# EAGLE board LiPoLoader (EAGLE 5.07)
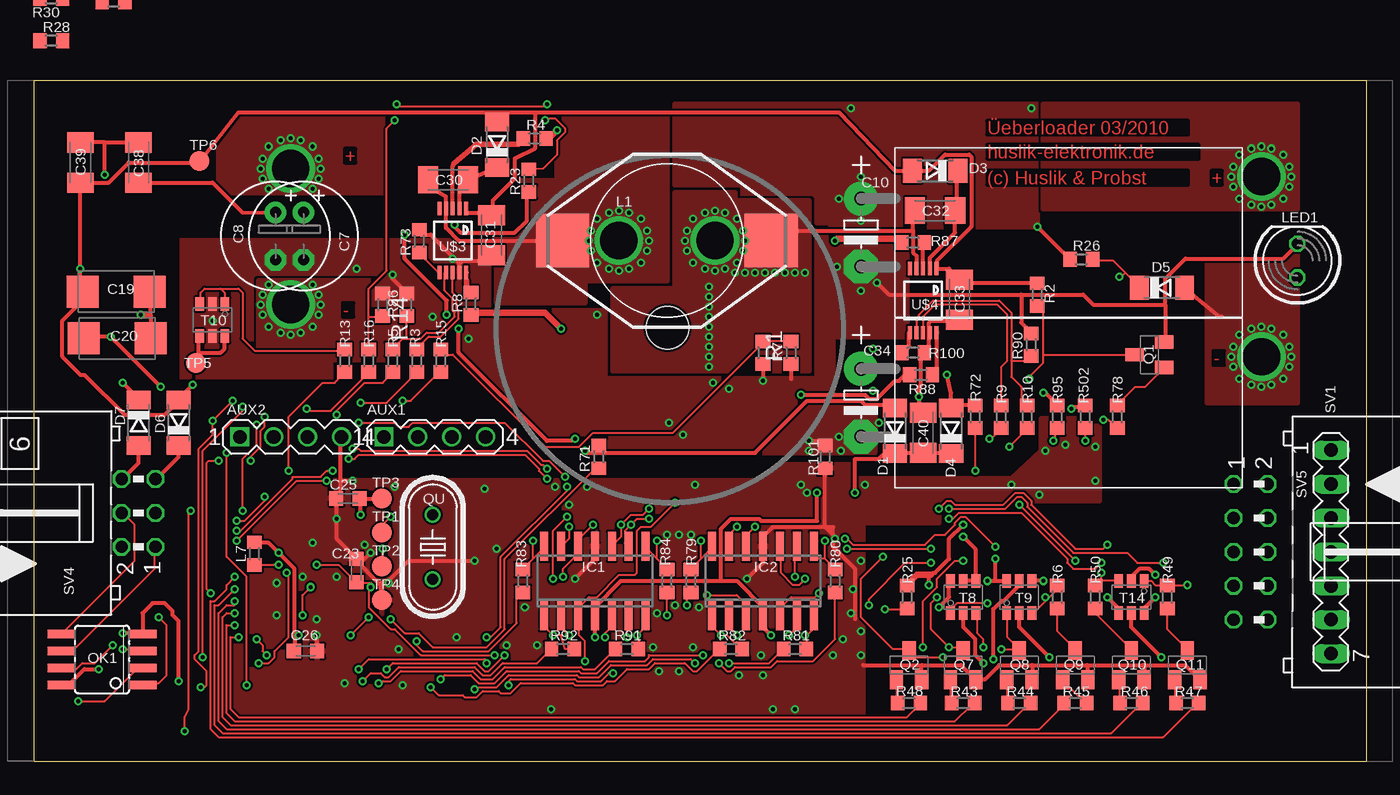
[diagram p2: board, top side]
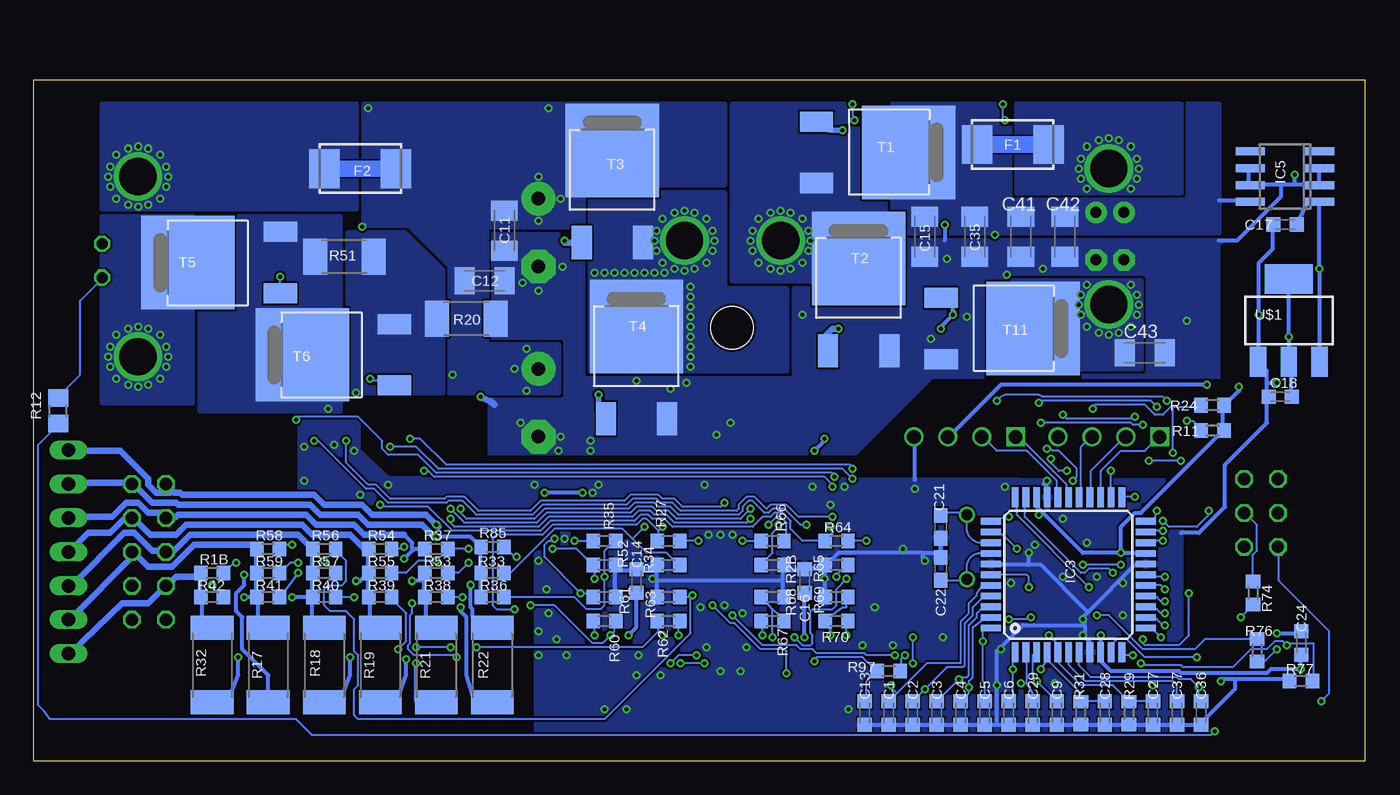
[diagram p3: board, bottom side, seen from below]

Size 99.8 x 51 mm. Coordinates in mm from the lower left corner, seen from the top.
Copper layers (1*16): Top 0.035mm / dielectric 1.5mm / Bottom 0.035mm
Design rules "Fischer-LP *": minimum track width 0.15mm, minimum drill 0.3mm, track to track 0.15mm, track to pad 0.15mm, pad to pad 0.15mm, via to via 0.15mm, smd to smd 0mil, copper to edge 0.2mm, drill to drill 0.3mm, minimum pad ring 0.2mm, minimum via ring 0.15mm, stop-mask expansion 0.1mm, vias tented up to drill 0.5mm, thermal gap 0.15mm
Net classes: 1 Hi-Power: width 0.3 mm; 2 Lo-Power: width 0.3 mm; 3 Iso-bus: clearance 0.6 mm to class 0, clearance 0.6 mm to class 1, clearance 0.6 mm to class 2
Holes 3.2 mm at 47.46,32.46
tRestrict: 16 lines
bRestrict: 9 lines
vRestrict: area 22.6,28.6 to 30.4,29.9

## Footprints (pad centres in the part's own frame; a part is rotated, then mirrored left to right if it is on the bottom)
MA04-1 = drill 1.016 square: 1 -3.81,0 | drill 1.016 round: 2 -1.27,0; 3 1.27,0; 4 3.81,0
SOLPAD3MM = drill 2.8 round: P$1 0,0
C0603K = smd 1.05 x 1.08: 1 -0.875,0; 2 0.875,0
E3,5-8 = drill 0.813 pad 1.6 round: + -1.778,0 | drill 0.813 pad 1.6 octagon: - 1.778,0
E5-13-L = drill 1.016 pad 2.54 round: + -2.54,0 | drill 1.016 pad 2.54 octagon: - 2.54,0
C1206K = smd 1.5 x 2: 1 -1.5,0; 2 1.5,0
SMC_C = smd 2.4 x 2.4: + -2.5,0; - 2.5,0
C0603 = smd 1.1 x 1: 1 -0.85,0; 2 0.85,0
SOD80C = smd 1.4 x 1.8: A 1.7,0; C -1.7,0
WSC2515 = smd 2.29 x 2.92: 1 -2.675,0; 2 2.675,0
SO14 = smd 0.6 x 2.2: 1 -3.81,-2.6; 2 -2.54,-2.6; 3 -1.27,-2.6; 4 0,-2.6; 5 1.27,-2.6; 6 2.54,-2.6; 7 3.81,-2.6; 8 3.81,2.6; 9 2.54,2.6; 10 1.27,2.6; 11 0,2.6; 12 -1.27,2.6; 13 -2.54,2.6; 14 -3.81,2.6
TQFP44 = smd 1.5 x 0.5: 1 -5.8,4; 2 -5.8,3.2; 3 -5.8,2.4; 4 -5.8,1.6; 5 -5.8,0.8; 6 -5.8,0; 7 -5.8,-0.8; 8 -5.8,-1.6; 9 -5.8,-2.4; 10 -5.8,-3.2; 11 -5.8,-4; 23 5.8,-4; 24 5.8,-3.2; 25 5.8,-2.4; 26 5.8,-1.6; 27 5.8,-0.8; 28 5.8,0; 29 5.8,0.8; 30 5.8,1.6; 31 5.8,2.4; 32 5.8,3.2; 33 5.8,4 | smd 0.5 x 1.5: 12 -4,-5.8; 13 -3.2,-5.8; 14 -2.4,-5.8; 15 -1.6,-5.8; 16 -0.8,-5.8; 17 0,-5.8; 18 0.8,-5.8; 19 1.6,-5.8; 20 2.4,-5.8; 21 3.2,-5.8; 22 4,-5.8; 34 4,5.8; 35 3.2,5.8; 36 2.4,5.8; 37 1.6,5.8; 38 0.8,5.8; 39 0,5.8; 40 -0.8,5.8; 41 -1.6,5.8; 42 -2.4,5.8; 43 -3.2,5.8; 44 -4,5.8
SO08 = smd 0.6 x 2.2: 1 -1.905,-2.6; 2 -0.635,-2.6; 3 0.635,-2.6; 4 1.905,-2.6; 5 1.905,2.6; 6 0.635,2.6; 7 -0.635,2.6; 8 -1.905,2.6
D333 = smd 4 x 4: 1 -7.82,0; 2 7.82,0
R0603 = smd 1 x 1.1: 1 -0.85,0; 2 0.85,0
LED5MM = drill 0.813 octagon: A -1.27,0; K 1.27,0
SOIC08 = smd 0.66 x 2.032: 1 -1.905,-3.073; 2 -0.635,-3.073; 3 0.635,-3.073; 4 1.905,-3.073; 5 1.905,3.073; 6 0.635,3.073; 7 -0.635,3.073; 8 -1.905,3.073
SOT23-BEC = smd 1 x 1.4: B -0.95,-1.1; C 0,1.1; E 0.95,-1.1
HC49U-V = drill 0.813 round: 1 -2.413,0; 2 2.413,0
R0805 = smd 1.3 x 1.5: 1 -0.95,0; 2 0.95,0
R2512 = smd 1.8 x 3.2: 1 -2.8,0; 2 2.8,0
R2010 = smd 1.8 x 2.7: 1 -2.2,0; 2 2.2,0
MA07-1 = drill 1.016 long: 1 -7.62,0; 2 -5.08,0; 3 -2.54,0; 4 0,0; 5 2.54,0; 6 5.08,0; 7 7.62,0
ML6L = drill 0.914 octagon: 1 -2.54,-1.27; 2 -2.54,1.27; 3 0,-1.27; 4 0,1.27; 5 2.54,-1.27; 6 2.54,1.27
ML10L = drill 0.914 octagon: 1 -5.08,-1.27; 2 -5.08,1.27; 3 -2.54,-1.27; 4 -2.54,1.27; 5 0,-1.27; 6 0,1.27; 7 2.54,-1.27; 8 2.54,1.27; 9 5.08,-1.27; 10 5.08,1.27
DPAK = smd 1.5 x 2.5: 1 -2.3,-6.9; 3 2.3,-6.9 | smd 7 x 7: 4 0,0
SUPERSOT-6 = smd 0.65 x 1: P$1 -0.95,-1.2; P$2 0,-1.2; P$3 0.95,-1.2; P$4 0.95,1.2; P$5 0,1.2; P$6 -0.95,1.2
TP15R = smd 1.5 x 1.5: TP 0,0
SOT223 = smd 1.219 x 2.235: LEFT -2.311,-3.099; MID 0,-3.099; RIGHT 2.311,-3.099 | smd 3.6 x 2.2: TAP 0,3.099
MSOP10W = smd 0.3 x 1: 1 -1,-2.4; 2 -0.5,-2.4; 3 0,-2.4; 4 0.5,-2.4; 5 1,-2.4; 6 1,2.4; 7 0.5,2.4; 8 0,2.4; 9 -0.5,2.4; 10 -1,2.4

## Placement (x,y rotation side)
AUX1  aux  [MA04-1]  30,24.3 0 top
AUX2  encoder  [MA04-1]  19.2,24.3 0 top
BATT+  SOLPAD3MM  [SOLPAD3MM]  91.95,43.8 0 top
BATT-  SOLPAD3MM  [SOLPAD3MM]  91.95,30.3 0 top
C1  100n  [C0603K]  35.7,3.6 90 bottom
C2  100n  [C0603K]  33.9,3.6 90 bottom
C3  100n  [C0603K]  32.1,3.6 90 bottom
C4  100n  [C0603K]  30.3,3.6 90 bottom
C5  100n  [C0603K]  28.5,3.6 90 bottom
C6  100n  [C0603K]  26.7,3.6 90 bottom
C7  330µF / 25V  [E3,5-8]  20.16,39.34 270 top
C8  330µF / 25V  [E3,5-8]  18.07,39.34 270 top
C9  100n  [C0603K]  23.1,3.6 90 bottom
C10  1000µF/35V  [E5-13-L]  61.95,39.6 270 top
C11  1u  [C1206K]  64.5,39.75 90 bottom
C12  10µF  [C1206K]  66,36 0 bottom
C13  100n  [C0603K]  37.5,3.6 90 bottom
C14  100n  [C0603K]  54.6,13.5 270 bottom
C15  1u  [C1206K]  33,39.3 90 bottom
C16  100n  [C0603K]  42,13.5 270 bottom
C17  100n  [C0603K]  6,40.2 0 bottom
C18  100n  [C0603K]  6.35,27.3 0 bottom
C19  100u Tan  [SMC_C]  6.13,35.18 0 top
C20  100u Tan  [SMC_C]  6.2,31.67 0 top
C21  10p  [C0603]  31.8,17.55 90 bottom
C22  10p  [C0603]  31.8,14.4 270 bottom
C23  100n  [C0603K]  24.13,14.29 270 top
C24  100n  [C0603K]  4.78,8.86 270 bottom
C25  100n  [C0603K]  23.5,19.68 0 top
C26  100n  [C0603K]  20.32,8.26 180 top
C27  100n  [C0603K]  15.9,3.6 90 bottom
C28  100n  [C0603K]  19.5,3.6 90 bottom
C29  100n  [C0603K]  24.9,3.6 90 bottom
C30  1u  [C1206K]  31.01,43.56 0 top
C31  1u  [C1206K]  34.26,39.41 90 top
C32  1u  [C1206K]  67.5,41.25 0 top
C33  1u  [C1206K]  69.33,34.58 90 top
C34  1000µF/35V  [E5-13-L]  61.95,26.85 270 top
C35  10µF  [C1206K]  29.25,39.3 270 bottom
C36  100n  [C0603K]  12.3,3.6 90 bottom
C37  100n  [C0603K]  14.1,3.6 90 bottom
C38  1u  [C1206K]  7.8,44.85 270 top
C39  1u  [C1206K]  3.45,44.85 270 top
C40  1u  [C1206K]  66.6,24.6 270 top
C41  10µF  [C1206K]  25.8,39.3 270 bottom
C42  10µF  [C1206K]  22.5,39.3 270 bottom
C43  10µF  [C1206K]  16.5,30.6 0 bottom
COIL1  SOLPAD3MM  [SOLPAD3MM]  43.8,39 0 top
COIL2  SOLPAD3MM  [SOLPAD3MM]  51,39 0 top
D1  LL43-GS08  [SOD80C]  64.5,24.75 90 top
D2  LL43-GS08  [SOD80C]  34.67,46.18 90 top
D3  LL43-GS08  [SOD80C]  67.5,44.25 180 top
D4  LL43-GS08  [SOD80C]  68.7,24.75 90 top
D5  15V BZT55C15  [SOD80C]  84.5,35.48 0 top
D6  LL43-GS08  [SOD80C]  10.8,25.35 90 top
D7  LL43-GS08  [SOD80C]  7.8,25.35 270 top
F1  Fuse 10A  [WSC2515]  26.4,46.2 0 bottom
F2  Fuse 10A  [WSC2515]  75.3,44.4 180 bottom
IC1  LM224D  [SO14]  42,13.5 0 top
IC2  LM224D  [SO14]  54.6,13.5 0 top
IC3  AVR_XMEGA_A4_44A  [TQFP44]  22.23,13.97 90 bottom
IC5  78L12SMD  [SO08]  6,43.8 90 bottom
L1  COILCRAFT_D333  [D333]  47.4,39 0 top
L7  27nH  [R0603]  16.49,15.56 90 top
LED1  [LED5MM]  94.65,37.5 90 top
OK1  ILD217  [SOIC08]  5.08,7.62 90 top
Q1  BC817-25SMD  [SOT23-BEC]  83.55,30.45 90 top
Q2  BC817-25SMD  [SOT23-BEC]  65.55,7.2 0 top
Q7  BC817-25SMD  [SOT23-BEC]  69.6,7.2 0 top
Q8  BC817-25SMD  [SOT23-BEC]  73.8,7.2 0 top
Q9  BC817-25SMD  [SOT23-BEC]  78,7.2 0 top
Q10  BC817-25SMD  [SOT23-BEC]  82.2,7.2 0 top
Q11  BC817-25SMD  [SOT23-BEC]  86.4,7.2 0 top
QU  16MHz  [HC49U-V]  29.85,16.05 90 top
R1  2k2  [R0603]  56.7,30.6 90 top
R1B  43k - 0.1%  [R0603]  86.4,14.1 0 bottom
R2  10k  [R0603]  75.15,34.95 90 top
R2B  20k - 0.1%  [R0603]  44.4,14.7 180 bottom
R3  0R  [R0603]  28.65,30 90 top
R4  10  [R0603]  37.49,46.66 180 top
R5  0R  [R0603]  26.85,30 90 top
R6  10k  [R0603]  76.65,12.3 90 top
R7  NB12K00103JBB  [R0603]  54.6,30.6 90 top
R8  10  [R0603]  32.72,34.27 90 top
R9  0R  [R0603]  72.45,25.8 270 top
R10  0R  [R0603]  74.4,25.8 270 top
R11  2k2  [R0603]  11.43,24.77 0 bottom
R12  330  [R0805]  97.95,26.25 90 bottom
R13  0R  [R0603]  23.25,30 90 top
R14  2k2  [R0603]  26.1,34.2 270 top
R15  0R  [R0603]  30.45,30 270 top
R16  0R  [R0603]  25.05,30 270 top
R17  10  [R2512]  82.2,7.2 270 bottom
R18  10  [R2512]  78,7.2 270 bottom
R19  10  [R2512]  73.8,7.2 270 bottom
R20  0.005R  [R2010]  67.35,33.15 180 bottom
R21  10  [R2512]  69.6,7.2 270 bottom
R22  10  [R2512]  65.4,7.2 270 bottom
R23  NB12K00103JBB  [R0603]  37.05,43.5 90 top
R24  2k2  [R0603]  11.43,26.67 0 bottom
R25  43k - 0.1%  [R0603]  65.4,12.3 270 top
R26  100k  [R0603]  78.45,37.6 0 top
R27  20k - 0.1%  [R0603]  52.2,16.5 180 bottom
R28  33k - 0.1%  [R0603]  1.27,53.98 0 top
R29  10k - 0.1%  [R0603]  17.7,3.6 270 bottom
R30  43k - 0.1%  [R0603]  1.27,57.15 180 top  (outside the outline)
R31  10k - 0.1%  [R0603]  21.3,3.6 270 bottom
R32  10  [R2512]  86.4,7.2 270 bottom
R33  43k - 0.1%  [R0603]  65.4,14.1 0 bottom
R34  20k - 0.1%  [R0603]  52.2,14.7 0 bottom
R35  20k - 0.1%  [R0603]  57,16.5 0 bottom
R36  43k - 0.1%  [R0603]  65.4,12.3 0 bottom
R37  43k - 0.1%  [R0603]  69.6,15.9 0 bottom
R38  10k  [R0603]  69.6,12.3 180 bottom
R39  10k  [R0603]  73.8,12.3 180 bottom
R40  10k  [R0603]  78,12.3 180 bottom
R41  10k  [R0603]  82.2,12.3 180 bottom
R42  10k  [R0603]  86.4,12.3 180 bottom
R43  4k7  [R0603]  69.6,4.35 180 top
R44  4k7  [R0603]  73.8,4.35 180 top
R45  4k7  [R0603]  78,4.35 0 top
R46  4k7  [R0603]  82.2,4.35 180 top
R47  4k7  [R0603]  86.4,4.35 180 top
R48  4k7  [R0603]  65.55,4.35 180 top
R49  10k  [R0603]  84.9,12.3 90 top
R50  10k  [R0603]  79.5,12.3 90 top
R51  0.1R  [R2010]  76.5,37.8 180 bottom
R52  20k - 0.1%  [R0603]  57,14.7 180 bottom
R53  43k - 0.1%  [R0603]  69.6,14.1 0 bottom
R54  43k - 0.1%  [R0603]  73.8,15.9 0 bottom
R55  43k - 0.1%  [R0603]  73.8,14.1 0 bottom
R56  43k - 0.1%  [R0603]  78,15.9 0 bottom
R57  43k - 0.1%  [R0603]  78,14.1 0 bottom
R58  43k - 0.1%  [R0603]  82.2,15.9 0 bottom
R59  43k - 0.1%  [R0603]  82.2,14.1 0 bottom
R60  20k - 0.1%  [R0603]  57,10.5 0 bottom
R61  20k - 0.1%  [R0603]  57,12.3 180 bottom
R62  20k - 0.1%  [R0603]  52.2,10.5 180 bottom
R63  20k - 0.1%  [R0603]  52.2,12.3 0 bottom
R64  20k - 0.1%  [R0603]  39.6,16.5 180 bottom
R65  20k - 0.1%  [R0603]  39.6,14.7 0 bottom
R66  20k - 0.1%  [R0603]  44.4,16.5 0 bottom
R67  10k - 0.1%  [R0603]  44.4,10.5 0 bottom
R68  2k - 0.1%  [R0603]  44.4,12.3 0 bottom
R69  2k - 0.1%  [R0603]  39.6,12.3 180 bottom
R70  36k - 0.1%  [R0603]  39.6,10.5 180 bottom
R71  120k - 0.1%  [R0603]  42.3,22.8 270 top
R72  120k - 0.1%  [R0603]  70.5,25.8 270 top
R73  10k  [R0603]  28.84,38.97 90 top
R74  820  [R0603]  8.4,12.6 270 bottom
R76  820  [R0603]  8.1,8.31 90 bottom
R77  10k  [R0603]  4.8,6 180 bottom
R78  4k7  [R0603]  81.15,25.8 90 top
R79  10k  [R0603]  49.2,13.5 90 top
R80  10k  [R0603]  60,13.5 90 top
R81  10k  [R0603]  57,8.4 0 top
R82  10k  [R0603]  52.2,8.4 0 top
R83  10k  [R0603]  36.6,13.5 90 top
R84  10k  [R0603]  47.4,13.5 90 top
R85  10k  [R0603]  65.4,16.05 180 bottom
R86  10k  [R0603]  27.9,34.2 90 top
R87  10  [R0603]  65.85,38.85 0 top
R88  10  [R0603]  66.45,28.95 0 top
R90  10k  [R0603]  74.7,31.2 90 top
R91  10k  [R0603]  44.4,8.4 0 top
R92  10k  [R0603]  39.6,8.4 0 top
R93  18k - 0.1%  [R0603]  1.49,59.53 0 top  (outside the outline)
R94  63k4 - 0.1%  [R0603]  0.85,62.2 0 top  (outside the outline)
R95  2k - 0.1%  [R0603]  76.65,25.8 90 top
R96  1k - 0.1%  [R0603]  5.3,62.76 0 top  (outside the outline)
R97  120k - 0.1%  [R0603]  35.7,6.75 180 bottom
R98  27k - 0.1%  [R0603]  6.57,59.79 0 top  (outside the outline)
R99  43k - 0.1%  [R0603]  5.93,56.9 0 top  (outside the outline)
R100  10k  [R0603]  65.85,30.6 0 top
R101  0R  [R0603]  59.25,22.8 90 top
R502  0R  [R0603]  78.75,25.8 270 top
SUPP+  SOLPAD3MM  [SOLPAD3MM]  19.2,44.4 0 top
SUPP-  SOLPAD3MM  [SOLPAD3MM]  19.2,34.2 0 top
SV1  spare  [MA07-1]  97.16,15.68 270 top
SV4  comm  [ML6L]  7.8,18.6 90 top
SV5  [ML10L]  91.14,15.68 270 top
T1  MOSFET-NIRLR8743  [DPAK]  34.21,45.62 270 bottom
T2  MOSFET-NIRLR8743  [DPAK]  37.95,37.65 0 bottom
T3  MOSFET-NIRLR8743  [DPAK]  56.4,45.75 0 bottom
T4  MOSFET-NIRLR8743  [DPAK]  54.6,32.55 0 bottom
T5  MOSFET-NIRLR8743  [DPAK]  88.2,37.35 90 bottom
T6  MOSFET-NIRLR8743  [DPAK]  79.65,30.45 90 bottom
T8  QS6J1=FDC6312P  [SUPERSOT-6]  69.6,12.3 0 top
T9  QS6J1=FDC6312P  [SUPERSOT-6]  73.8,12.3 0 top
T10  FDC6401N  [SUPERSOT-6]  13.33,33.05 180 top
T11  MOSFET-NIRLR8743  [DPAK]  24.88,32.41 270 bottom
T14  QS6J1=FDC6312P  [SUPERSOT-6]  82.2,12.3 180 top
TP1  TPTP15R  [TP15R]  26.04,17.14 0 top
TP2  TPTP15R  [TP15R]  26.04,14.61 0 top
TP3  TPTP15R  [TP15R]  26.04,19.68 0 top
TP4  TPTP15R  [TP15R]  26.04,12.06 0 top
TP5  TPTP15R  [TP15R]  12.1,29.84 0 top
TP6  TPTP15R  [TP15R]  12.35,44.98 0 top
U$1  LM1117  [SOT223]  5.71,33.02 0 bottom
U$2  [GEH_FISCHER_AKG55XX100]  0,0 0 top
U$3  LM5106  [MSOP10W]  31.35,39 180 top
U$4  LM5106  [MSOP10W]  66.6,34.5 180 top

## Tracks (layer width: path | path; a pad name or v marks a point on that pad's centre or on a via)
0V  (via drill 0.3)
  Top 0.3: 31.88,37.27 32.1,37.5 33.9,37.5 C31.1 | 31.88,37.27 31.8,37.2 31.8,36.6 U$3.9 | 31.43,37.73 29.7,39.45 28.95,39.45 R73.2 | 31.43,37.73 31.88,37.27 | 31.43,37.73 v31.35,37.65 | C33.1 69.3,33 67.2,33 67.05,32.85 67.05,32.1 | 84.75,34.2 84.75,31.5 Q1.E | 84.75,34.2 84.75,36.15 86.25,37.65 93.6,37.65 94.65,38.7 LED1.K | C33.1 69.3,32.85 | 5.25,46.35 C38.1 | 5.25,46.35 C39.1 | v5.25,43.95 5.25,46.35 | C33.1 69.45,33.15 | 59.25,23.7 R101.2 59.25,24 v58.05,24 | C40.1 66.3,26.4 v66.3,27.3 66.3,28.05 66.45,28.2 66.45,30.45 66.6,30.6 R100.2 66.75,30.6 67.05,30.9 67.05,32.1 | 67.05,32.1 U$4.9 | v31.5,40.2 31.5,40.05 31.95,39.6 36,39.6 36.9,40.5 36.9,42.45 37.05,42.6 R23.1 | v63.15,35.85 64.05,34.95 73.95,34.95 | 73.95,34.95 78.6,34.95 79.35,34.2 84.75,34.2 | 54.6,29.85 R7.1 v54.6,28.5 | C10.- 61.95,37.2 | R86.2 27.9,35.1 26.85,36.15 v26.85,36.45 | 73.95,34.95 73.95,32.85 74.7,32.1 R90.2 | R14.1 26.1,35.1 26.96,35.1 | R1.1 56.7,28.65
  Bottom 0.3: IC5.3 3.45,44.4 3.45,43.2 IC5.2 3.6,43.2 5.25,43.2 | IC5.6 8.7,44.4 8.7,43.2 IC5.7 8.55,43.2 6.3,43.2 | 5.25,43.2 6.3,43.2 | 6.3,43.2 6.3,42.3 9.6,39 11,39 | 5.25,43.2 v5.25,43.95 | v31.5,40.2 31.5,39
  Bottom 0.5: v66.3,27.3 65.4,26.85 65.25,26.7 65.55,26.95
  other vias: 13.35,33 60.3,24.3 63.3,25.35 61.95,35.25 60.15,37.05 58.05,23.25 60.45,23.25 48.6,24.45 52.05,27.9 50.85,28.35 47.55,25.35 42.15,33.45 29.85,33.3 32.55,31.65 24.15,36.9
  pour Top (no thermals): 15.06,34.96 11.6,34.96 11.6,31.15 15.06,31.15
  pour Bottom (rank 4, no thermals): 10.8,39 10.8,28.8 32.4,28.8 38.4,22.8 65.55,22.8 65.55,39.45 58.65,39.45 58.65,28.65 42.75,28.65 42.75,35.4 35.4,35.4 35.4,39
  pour Top (no thermals): 60.6,23.1 57.9,23.1 57.9,24.45 60.6,24.45
  pour Top (rank 4, no thermals): 10.95,39 34.05,39 34.05,33.75 42.75,33.75 42.75,28.65 58.65,28.65 58.65,39.45 65.4,39.45 65.4,31.8 59.85,31.8 59.85,27.15 63,27.15 63,23.1 38.25,23.1 32.55,28.8 10.95,28.8
+3V3  (via drill 0.3)
  Top 0.3: v4.8,6.9 3.75,6.9 2.7,5.85 2.1,5.85 OK1.8 | 19.5,9.45 19.5,14.4 v18.3,15.6 17.55,16.35 16.5,16.35 L7.2 | 19.5,9.45 19.5,8.4 C26.2 | v19.8,9.45 19.5,9.45 | TP3.TP 25.95,19.65 24.45,19.65 C25.2 24.45,19.5 v24.45,18.45 | C20.+ 3.75,31.8 v5.7,31.8 v9.45,28.05
  Bottom 0.3: C24.2 4.8,7.95 v4.8,6.9 7.05,6.9 7.35,6.6 13.8,6.6 13.95,6.75 19.05,6.75 19.8,7.5 19.8,8.1 IC3.9 19.8,8.25 v19.8,9.45 | C18.2 5.55,27.45 5.55,29.7 5.7,29.85 U$1.MID 5.7,30.15 v5.7,31.8 5.7,36 U$1.TAP | v18.3,15.6 21.15,15.6 24.23,18.68 | v18.3,15.6 16.5,15.6 IC3.19 | 24.23,18.68 24.6,19.05 24.6,19.65 IC3.31 | v18.3,15.6 18.3,17.55 17.25,18.6 16.8,18.6 10.65,24.75 R11.2 10.65,24.9 10.65,26.55 R24.2 10.5,26.7 9.45,27.75 v9.45,28.05 | 24.23,18.68 v24.45,18.45
+12V  (via drill 0.3)
  Top 0.3: C31.2 33.9,40.5 | 67.65,36.9 68.55,36.9 69.3,36.15 C33.2 | C33.2 69.45,36 | D3.A 67.05,44.25 68.25,45.45 70.05,45.45 70.2,45.3 70.2,40.05 67.65,37.5 67.65,36.9 | 34.8,48.6 15.3,48.6 12.45,45 TP6.TP 12.3,44.85 7.05,44.85 5.55,43.35 C39.2 v3.45,36.9 3.45,35.4 3.6,35.25 C19.+ 3.6,35.1 3.6,34.5 2.1,33 2.1,30.3 3.45,28.95 3.75,28.95 6.75,25.95 9.75,25.95 10.8,27 D6.A 10.8,27.15 v11.85,28.2 | 34.8,48.6 34.8,48 D2.A | 34.35,40.8 34.35,40.65 C31.2 | C31.2 33.42,41.05 32.35,41.05 U$3.1 | 67.65,36.9 U$4.1 | D3.A 64.5,44.25 60.3,48.6 37.5,48.6 | 34.8,48.6 37.5,48.6 | D3.A 65.7,44.25 | R2.2 75.15,35.85 69.33,35.85 C33.2 | 37.5,48.6 37.5,45.9 36,45.15 36,43.65 34.35,42
  Top 0.305: 34.35,42 34.35,40.8
  Bottom 0.3: C17.2 5.1,40.2 4.35,41.85 IC5.1 3.45,41.7 v3.45,36.9 3.45,30 U$1.RIGHT | v11.85,28.2 27.3,28.2 31.2,24.3 AUX1.3
+UB  (via drill 0.3)
  Top 0.3: 70.2,26.7 70.5,26.7 R72.1 70.05,26.7 68.7,26.7 | 68.7,26.7 68.55,26.55 D4.A 68.7,26.7 | 68.7,26.7 68.7,27.6 v68.4,28.95 | R26.1 77.55,37.65 v75.15,40.05
  Bottom 0.3: v75.15,40.05 75,40.16
  other vias: 60.3,42.15 61.95,40.5 61.95,43.8 62.85,27.75 63.75,29.4 62.85,30.9 61.2,48.9 74.7,48.9
  pour Bottom (rank 2, no thermals): 48,49.2 48,43.2 57.6,43.2 57.6,40.05 75,40.05 75,49.2
  pour Bottom (rank 2, no thermals): 65.85,40.2 65.85,31.2 60.45,31.2 60.45,27.6 68.7,27.6 68.7,36.9 71.85,40.05 68.7,40.05
  pour Top (rank 2, no thermals): 75.15,49.2 48,49.2 48,43.2 53.1,43.2 53.1,42.45 58.65,42.45 58.65,40.35 59.7,40.35 59.7,40.05 75.15,40.05
AVCC  (via drill 0.3)
  Top 0.15: v18.3,14.7 L7.1 | v21.15,14.7 22.8,14.7 24,13.5 C23.2 24.15,13.35 25.2,13.35 25.35,13.2 v25.2,13.05 25.05,12.9 25.05,11.55 26.7,9.9 27,9.9 28.95,7.95 v34.5,7.95
  Bottom 0.15: v18.3,14.7 v21.15,14.7 | v25.2,13.05 25.2,13.8 25.35,13.95 27.75,13.95 27.9,14.1 IC3.39 | v34.5,7.95 34.8,7.65 34.8,6.75 R97.1
BALANCE1  (via drill 0.3)
  Top 0.15: R48.1 66.3,4.2 65.4,3.3 15.3,3.3 14.7,3.9 14.7,9.3 v15.3,9.3
  Bottom 0.15: v15.3,9.3 15.9,9.9 IC3.12
BALANCE2  (via drill 0.3)
  Top 0.15: R43.1 70.2,4.2 69,3 15,3 14.4,3.6 14.4,10.2 v15,10.2
  Bottom 0.15: v15,10.2 15.15,10.2 15.6,10.65 16.2,10.65 16.2,10.8 IC3.13
BALANCE3  (via drill 0.3)
  Top 0.15: R44.1 74.4,4.2 72.9,2.7 14.7,2.7 14.1,3.3 14.1,10.8 14.4,11.1 v15,11.1
  Bottom 0.15: v15,11.1 15.3,11.1 15.6,11.4 16.2,11.4 IC3.14
BALANCE4  (via drill 0.3)
  Top 0.15: R45.1 77.1,4.2 75.3,2.4 14.4,2.4 13.8,3 13.8,11.1 14.4,11.7 15,11.7 v15,12
  Bottom 0.15: v15,12 15.3,12 15.6,12.3 16.2,12.3 IC3.15
BALANCE5  (via drill 0.3)
  Top 0.15: R46.1 82.8,4.2 80.7,2.1 14.1,2.1 13.5,2.7 13.5,11.7 13.8,11.7 v15,12.9
  Bottom 0.15: IC3.16 16.2,13.2 15.3,13.2 v15,12.9
BALANCE6  (via drill 0.3)
  Top 0.15: R47.1 87,4.2 84.6,1.8 13.8,1.8 13.2,2.4 13.2,12 13.5,12 14.4,12.9 14.4,13.2 v15,13.8
  Bottom 0.15: IC3.17 16.2,13.8 v15,13.8
BATT-  (via drill 0.3)
  Top 0.3: D5.A 86.25,35.4 88.8,33.3 88.95,33.3
  other vias: 93.6,31.95 91.95,32.55 91.95,28.05 94.2,30.3 89.7,30.3 89.85,31.05 90.3,31.95 91.2,32.4 92.7,32.4 91.2,28.2 92.7,28.2 94.05,29.55 94.05,31.05 93.6,28.65 89.85,29.55 90.3,28.65
  pour Bottom (no thermals): 87.9,40.8 87.9,26.85 94.65,26.85 94.65,40.8
  pour Top (no thermals): 87.9,40.8 87.9,26.85 94.65,26.85 94.65,40.8
BATT-A  (via drill 0.3)
  Top 0.3: R502.1 78.75,26.55 77.85,26.55 v77.7,26.4
  pour Bottom (no thermals): 76.8,40.8 76.8,36 76.8,26.25 87.3,26.25 87.3,40.8
BATT-B  (via drill 0.3)
  Top 0.3: R95.2 76.65,26.7 75.75,27.6 v75.6,27.6
  Bottom 0.3: v75.6,27.6 75.8,27.6
  pour Bottom (no thermals): 69.15,36.75 72,39.6 76.2,39.6 76.2,35.4 76.05,27.6 69.15,27.6
BUS_GND  (via drill 0.3)
  Top 0.15: v3.3,4.5 5.25,4.5 7.65,6.9 8.1,6.9 OK1.2
  Bottom 0.15: v3.3,4.5 2.7,5.1 2.7,9.75 6.45,13.5 6.45,16.05 SV4.2
BUS_RX
  Bottom 0.15: R74.1 8.4,15.45 8.1,15.75 8.1,17.7 9,18.6 SV4.3
BUS_SUPP
  Top 0.15: OK1.6 3,8.25 3,8.4 9,14.4 9,16.05 SV4.1
BUS_TX
  Top 0.15: SV4.4 6.6,18.6 7.5,17.7 7.5,15 2.1,9.6 OK1.5
CELL1  (via drill 0.3)
  Top 0.3: 70.5,13.5 70.5,15.9 v69.6,16.8 | 70.5,13.5 T8.P$5 | 70.5,13.5 T8.P$4
  Bottom 0.3: 66.3,14.1 66.3,12.3 R36.1 | 66.3,14.1 66.3,15.9 R85.2 66.3,16.05 67.05,16.8 v69.6,16.8 | 66.3,14.1 R33.1
  Bottom 0.5: v69.6,16.8 69.75,16.95 69.9,16.95 70.65,17.7 74.7,17.7 75.45,18.45 78.3,18.45 79.05,19.2 88.95,19.2 89.1,19.35 90.9,19.35 92.25,20.7 92.4,20.7 SV5.2 92.55,20.85 97.05,20.85 SV1.2
CELL2  (via drill 0.3)
  Top 0.3: v71.4,13.5 72,13.5 | 72,13.5 T9.P$6 | 72,13.5 v72,15.15
  Bottom 0.3: 70.5,13.5 70.5,12.3 R38.2 70.35,12.3 70.35,10.8 69.6,10.05 R21.1 | 70.5,13.5 70.5,13.95 R53.1 | 70.5,13.5 v71.4,13.5 | v72,15.15 71.33,15.82 | 71.33,15.82 71.25,15.9 R37.1 | 72,16.95 71.4,16.35 71.4,15.9 71.33,15.82
  Bottom 0.5: 72,16.95 75,16.95 75.75,17.7 78.6,17.7 79.35,18.45 88.95,18.45 89.1,18.3 89.85,18.3 SV5.3 90,18.45 90.15,18.6 91.2,18.6 91.95,19.35 92.85,19.35 93.9,18.3 97.05,18.3 SV1.3
CELL3  (via drill 0.3)
  Top 0.3: v75.6,13.5 T9.P$4
  Bottom 0.3: v75.6,13.5 75.3,13.5 74.7,14.1 | 74.7,14.1 74.7,15.75 R54.1 | 74.7,14.1 R55.1 74.7,13.95 74.7,12.3 R39.2 74.55,12.3 74.55,10.8 73.8,10.05 R19.1
  Bottom 0.5: R54.1 74.85,15.75 76.05,16.95 78.9,16.95 79.65,17.7 88.35,17.7 89.1,16.95 91.05,16.95 92.1,18 92.25,18 SV5.4 | SV5.4 92.4,18.15 | SV5.4 92.4,18.45 92.55,18.6 94.05,17.1 95.7,17.1 97.05,15.75 SV1.4
CELL4  (via drill 0.3)
  Top 0.3: v80.4,12.3 81.15,11.55 81.15,11.1 T14.P$4
  Bottom 0.3: 78.9,14.1 78.9,15.75 R56.1 | 78.9,12.3 78.9,14.1 | 78.9,14.1 R57.1 | 78.9,12.3 R40.2 | 78.9,12.3 78.9,10.5 R18.1 | 78.9,12.3 v80.4,12.3
  Bottom 0.5: R56.1 78.9,15.9 79.95,16.95 88.05,16.95 89.25,15.75 89.85,15.45 SV5.5 | SV5.5 89.85,15.75 | SV5.5 90.3,15.75 90.9,15.75 92.25,17.1 93,17.1 96.9,13.2 SV1.5
CELL5  (via drill 0.3)
  Top 0.3: v84,12.3 83.25,11.55 83.25,11.1 T14.P$6
  Bottom 0.3: 83.1,14.1 83.1,15.6 R58.1 | 83.1,12.3 v84,12.3 | 83.1,12.3 83.1,14.1 | 83.1,14.1 R59.1 | 83.1,12.3 R41.2 82.95,12.3 82.95,10.8 82.2,10.05 R17.1
  Bottom 0.5: R58.1 83.1,15.9 83.4,16.2 87.75,16.2 89.4,14.55 91.2,14.55 92.25,15.6 SV5.6 92.25,15.45 97.05,10.65 SV1.6
CELL6
  Bottom 0.3: R1B.1 87.3,13.95 87.3,12.3 R42.2 87.15,12.3 87.15,10.8 86.4,10.05 R32.1
  Bottom 0.5: 87.3,14.1 R1B.1 87.45,13.95 87.6,13.8 89.1,13.8 89.7,13.2 SV5.7 | SV5.7 90,13.05 | SV1.7 97.05,8.1 93.15,11.85 92.55,11.85 91.2,11.85 90.15,12.9 SV5.7
CELLGND  (via drill 0.3)
  Top 0.3: 67.2,13.95 67.35,14.1 67.5,14.1 68.55,15.15 68.55,16.65 v69.6,17.7 | v67.05,13.2 67.05,13.95
  Top 0.5: 67.2,13.95 67.05,13.95 66.15,13.95 65.4,13.2 R25.1
  Bottom 0.3: v67.05,13.2 67.05,11.55 66.9,11.4 66.9,10.95 66.6,10.2 R22.1
  Bottom 0.5: 69.45,17.55 v69.6,17.7 70.35,18.45 74.4,18.45 75.15,19.2 78,19.2 78.75,19.95 88.65,19.95 88.8,20.1 89.25,20.1 89.4,20.25 | 89.4,20.25 89.85,20.7 SV5.1 | 89.4,20.25 89.55,20.1 90.6,20.1 91.2,20.7 91.2,21.15 93.3,23.25 97.05,23.25 SV1.1
CURR_SENS_SW  (via drill 0.3)
  Top 0.15: v15.6,18.75 15.6,22.65 16.65,23.7 v16.65,25.2 | v24.3,25.35 27,25.35 27.3,25.05 28.05,25.05 28.35,25.35 35.25,25.35 38.1,22.5 38.55,22.5 v39.75,21.3 | v80.1,25.57 80.47,25.57 81.15,25.05 R78.1
  Bottom 0.15: v15.6,18.75 15.75,18.15 IC3.22 | v16.65,25.2 17.4,25.2 17.55,25.35 v24.3,25.35 | v39.75,21.3 39.6,21.3 39.9,21.6 69.6,21.6 70.95,22.95 73.2,22.95 73.65,23.4 73.65,24 75.45,25.8 79.95,25.8 v80.1,25.57
GND  (via drill 0.3)
  Top 0.3: 59.25,17.55 55.35,17.55 54.6,16.8 IC2.11 54.6,14.85 v53.4,13.65 | 59.25,17.55 59.7,17.55 | 66.53,7.2 69.45,7.2 Q7.E 70.65,6.15 71.25,6.15 72.3,7.2 74.78,7.2 | Q2.E 66.45,6.15 66.45,7.12 66.53,7.2 | 74.78,7.2 74.78,6.15 Q8.E | 78.9,7.2 Q9.E | 74.78,7.2 78.9,7.2 | Q10.E 83.17,7.12 83.1,7.2 | 78.9,7.2 83.1,7.2 | 83.1,7.2 86.25,7.2 Q11.E | 59.85,16.95 59.85,16.05 61.5,14.4 61.5,10.65 | 59.85,16.95 59.85,17.55 | v40.5,13.65 42,15.15 IC1.11 | C23.1 24,15.3 22.65,16.65 22.65,19.65 C25.1 22.65,19.8 22.95,20.1 22.95,21 | 25.88,13.28 24,15.15 C23.1 | 25.88,13.28 25.95,13.2 25.95,12.15 TP4.TP | 22.95,21 22.95,24.3 AUX2.4 | 22.95,21 v23.85,21 | v6.6,28.35 7.8,27.15 D7.C | v21.15,9.45 21.15,8.4 C26.1 | v25.2,15.6 24.45,14.85 C23.1 | v33,15 28.05,15 26.4,13.35 25.95,13.35 25.88,13.28 | 8.7,33.45 8.7,35.1 C19.- | 8.7,33.45 C20.- | v7.95,33.45 8.7,33.45 | 59.25,17.55 R101.1 | 59.25,17.55 59.85,16.95 | 62.1,7.2 66.53,7.2 | v6.6,9.6 8.1,9.6 OK1.4 8.1,9.75 8.1,11.1 8.85,11.85 9.75,11.85 10.35,11.25 10.35,10.95 10.8,10.5 v10.8,6
  Bottom 0.3: 56.25,14.25 56.25,14.7 R52.1 56.25,14.25 | 56.25,14.25 56.25,12.3 R61.1 | 53.1,13.65 53.1,14.55 R34.1 53.1,14.7 53.4,14.4 54.6,14.4 C14.1 54.6,14.25 56.25,14.25 | 53.1,13.5 53.1,13.65 | 53.1,13.5 53.1,12.3 R63.1 | 43.65,14.25 43.65,14.7 R2B.1 43.65,14.25 | 43.65,14.25 43.65,13.5 | 43.65,13.5 43.65,12.3 R68.2 | R65.1 40.5,14.7 40.8,14.4 42,14.4 C16.1 42,14.25 43.65,14.25 | R69.2 40.5,12.3 v40.5,13.65 40.5,14.55 R65.1 | 43.65,13.5 53.1,13.5 | 31.8,15.6 C22.1 31.8,15.3 | 31.8,15.6 C21.1 31.8,16.8 | IC3.30 23.85,19.8 23.85,20.55 24.07,20.77 v23.85,21 | 33.15,15.6 31.8,15.6 | 33.15,15.6 39.45,15.6 40.35,14.7 R65.1 | 7.35,28.35 7.35,29.25 7.95,29.85 U$1.LEFT 7.95,30 v7.95,33.45 7.95,37.35 6.9,38.4 6.9,40.2 C17.1 | 7.35,28.35 7.35,27.45 C18.1 7.35,27.3 7.35,25.35 10.5,22.2 10.5,19.05 12.45,17.1 13.8,17.1 | 7.35,28.35 v6.6,28.35 | IC3.8 20.7,8.25 20.7,9 v21.15,9.45 21,9.45 21,10.2 | 20.77,11.18 21,10.95 21,10.2 | 20.77,11.18 17.25,14.7 16.5,14.7 IC3.18 | 25.2,14.7 24.3,14.7 20.77,11.18 | 25.2,14.7 27.9,14.7 IC3.38 | 14.1,2.7 12.3,2.7 C36.1 12.3,2.85 9.75,5.4 9.75,6 9.68,6.08 | 14.1,2.7 15.9,2.7 | 14.1,2.7 C37.1 | 17.7,2.7 19.5,2.7 | 21.3,2.7 23.1,2.7 | 23.1,2.7 24.9,2.7 | 23.1,2.7 C9.1 | 24.9,2.7 26.7,2.7 | 24.9,2.7 C29.1 | 26.7,2.7 27.6,2.7 | 27.6,2.7 28.5,2.7 | 26.7,2.7 C6.1 | 28.5,2.7 30.3,2.7 | 28.5,2.7 C5.1 | 30.3,2.7 32.1,2.7 | 30.3,2.7 C4.1 | 32.1,2.7 33.9,2.7 | 32.1,2.7 C3.1 | 33.9,2.7 35.7,2.7 | 33.9,2.7 C2.1 | 35.7,2.7 37.5,2.7 C13.1 | 35.7,2.7 C1.1 | 19.5,2.7 21.3,2.7 | 19.5,2.7 C28.1 | 21.3,2.7 R31.2 | 15.9,2.7 17.7,2.7 | 15.9,2.7 C27.1 | 17.7,2.7 R29.2 | 21,10.2 25.65,10.2 27.6,8.25 27.6,2.7 | 4.65,9.75 C24.1 4.8,9.6 v6.6,9.6 | 25.2,14.7 v25.2,15.6
  Bottom 0.3: 53.1,13.65 v53.4,13.65 | v33,15 33.15,15 33.15,15.6 | 9.68,6.08 9.6,6.15 6.15,6.15 5.7,6 R77.2 | v10.8,6 10.65,6.15 9.75,6.15 9.68,6.08 | AUX1.4 33.75,24.3 33.75,21.15 33.75,21.06
  other vias: 33.75,20.4 27.3,8.4 23.25,5.85 27.6,5.7 21.15,10.65 22.65,13.8 24.75,16.2 27,20.55 20.1,13.8 26.55,13.35 31.65,9.3 18.15,13.35 18.15,10.95 41.4,20.55 49.5,20.7 57.45,20.7 57.9,20.1 61.95,15 61.95,9.75 61.95,7.95 55.35,3.9 57,3.9 52.8,6.45 54.6,6.45 59.85,7.95 60.6,9.15 61.2,11.1 61.35,12.9 60,16.65 47.4,16.95 49.2,16.95 48.3,16.95 40.05,19.2 39,20.55 34.65,15.9 35.4,8.7 36.75,11.55 37.65,8.7 48,11.7 46.65,11.1 46.35,8.55 49.8,11.55 54.45,7.95 38.7,3.9 20.85,16.35 22.65,18.15 73.2,20.7 62.25,20.7 77.25,23.7 75.3,19.95 75.75,23.25 49.35,8.55 48.3,6.75 46.8,6.75 79.5,23.55 79.5,21
  pour Bottom: 13.8,21 62.1,21.15 73.2,21.15 75.45,23.25 75.45,25.65 79.8,25.65 79.8,19.05 62.1,19.05 62.1,2.25 13.8,2.1
  pour Top: 13.8,21 54.9,21 56.1,22.2 61.35,22.2 61.35,21.15 73.2,21.15 75.45,23.25 75.45,25.65 79.8,25.65 79.8,19.5 67.8,19.5 67.8,17.85 62.1,17.85 62.1,2.1 13.8,2.1
I_ACT_HI  (via drill 0.3)
  Top 0.15: v24.6,6 25.2,6.6 25.95,6.6 26.25,6.3 26.55,6.3 27.3,7.05 33,7.05 33.6,6.45 34.2,6.45 35.1,7.35 37.65,7.35 38.7,8.4 R92.1
  Bottom 0.15: IC3.3 24.75,8.1 24.9,7.95 24.9,6.3 v24.6,6 23.1,4.5 C9.2
I_ACT_LOW  (via drill 0.3)
  Top 0.15: v25.8,5.85 25.95,5.85 26.1,6 26.7,6 27.45,6.75 32.85,6.75 33.45,6.15 34.35,6.15 35.25,7.05 40.95,7.05 41.1,6.9 42,6.9 43.5,8.4 R91.1
  Bottom 0.15: C29.2 24.9,5.1 25.35,5.85 | 25.35,5.85 25.35,8.1 IC3.2 | 25.35,5.85 v25.8,5.85
I_RAW_HI_R  (via drill 0.3)
  Top 0.15: v41.25,7.5 41.25,9 40.8,9.45 40.8,10.8 IC1.3 40.8,10.95 40.8,11.55 41.55,12.3 42.15,12.3 43.8,13.95 45,13.95 45.15,14.1 45.15,17.25 45.45,17.55 46.2,17.55 v48,19.35 | v76.35,24 76.5,24.15 76.5,24.75 76.65,24.9 R95.1
  Bottom 0.15: 36.6,6.75 37.35,6 37.35,4.65 37.5,4.5 C13.2 | v41.25,7.5 41.25,7.65 41.1,7.8 37.65,7.8 36.6,6.75 | 36.6,6.75 R97.2 | v48,19.35 48.3,19.05 51.15,19.05 51.75,19.65 52.65,19.65 52.95,19.95 55.05,19.95 55.5,19.5 61.8,19.5 62.55,18.75 66.45,18.75 67.5,19.8 68.85,19.8 69,19.65 73.05,19.65 74.1,20.7 74.7,20.7 76.35,22.35 v76.35,24
I_RAW_LOW  (via drill 0.3)
  Top 0.15: v39.9,18.3 38.85,17.25 v38.85,13.65 | v42.75,9.3 42.75,9.6 43.2,10.05 IC1.5 | v78.75,24 R502.2
  Bottom 0.15: v39.9,18.3 42.45,18.3 43.35,19.2 44.55,19.2 44.85,18.9 45.75,19.8 46.35,19.8 46.95,19.2 46.95,18.9 47.1,18.75 51.3,18.75 51.9,19.35 52.8,19.35 53.1,19.65 54.9,19.65 55.35,19.2 61.65,19.2 62.4,18.45 66.6,18.45 67.65,19.5 68.7,19.5 68.85,19.35 73.2,19.35 74.25,20.4 74.85,20.4 78.45,24 v78.75,24 | v38.85,13.65 39.6,12.9 39.6,11.7 39.9,11.4 41.4,11.4 41.55,11.25 41.55,9.6 41.4,9.45 41.4,8.85 41.55,8.7 42.15,8.7 v42.75,9.3
LED1  (via drill 0.3)
  Top 0.15: v11.25,2.25 11.25,3.3 11.55,3.9 11.55,18.6 v11.7,18.75 | v15.15,18 15.75,18 17.25,19.5 v17.25,19.8
  Bottom 0.15: v11.25,2.25 11.55,1.95 78.9,1.95 80.1,3.15 98.55,3.15 99,3.75 99.45,4.2 99.45,23.7 97.95,25.2 R12.1 | v11.7,18.75 11.55,18.6 12.6,17.55 14.7,17.55 v15.15,18 | v17.25,19.8 18.15,19.8 IC3.23
MISO
  Bottom 0.15: IC3.26 20.55,19.8 20.55,21.75 18,24.3 AUX2.2
MOSI
  Bottom 0.15: IC3.25 19.8,19.8 19.8,21.75 18.3,23.25 16.5,23.25 15.45,24.3 AUX2.1
N$1  (via drill 0.3)
  Top 0.15: IC1.10 43.35,16.2 43.95,16.8 v43.95,17.7 44.7,18.45 45.6,18.45 v46.05,18.9 | v68.55,18.9 72.75,18.9 73.65,19.8 73.95,19.8 74.4,19.35 74.4,19.05 77.85,15.6 81.9,15.6 82.65,14.85 v84.6,14.85
  Bottom 0.15: R2B.2 45.15,14.85 44.4,15.6 44.4,17.1 43.95,17.55 v43.95,17.7 | v46.05,18.9 46.8,18.15 51.6,18.15 52.2,18.75 53.1,18.75 53.4,19.05 54.6,19.05 55.05,18.6 61.35,18.6 62.1,17.85 67.5,17.85 v68.55,18.9 | v84.6,14.85 84.75,14.85 85.5,14.1 R1B.2
N$2  (via drill 0.3)
  Top 0.15: v39.6,13.8 39.6,14.4 40.65,15.45 40.65,16.05 IC1.12 40.8,16.2 40.8,16.65 v41.85,17.7 | v67.8,18.9 68.4,19.5 68.7,19.5 69,19.2 72.6,19.2 73.5,20.1 74.1,20.1 74.7,19.5 74.7,19.2 78,15.9 80.1,15.9 v80.4,16.2
  Bottom 0.15: v39.6,13.8 39.6,13.95 38.85,14.7 R65.2 | v41.85,17.7 42.3,17.7 43.5,18.9 44.4,18.9 44.7,18.6 45,18.6 45.9,19.5 46.2,19.5 46.65,19.05 46.65,18.75 46.95,18.45 51.45,18.45 52.05,19.05 52.95,19.05 53.25,19.35 54.75,19.35 55.2,18.9 61.5,18.9 62.25,18.15 67.35,18.15 67.8,18.6 v67.8,18.9 | v80.4,16.2 81,16.2 81.3,15.9 R58.2
N$3  (via drill 0.3)
  Top 0.15: IC1.9 44.4,16.2 44.25,16.35 44.25,17.25 v44.7,17.7 45.15,18.15 v46.05,18.15 | v68.55,18.15 68.7,18 69.3,18.6 73.95,18.6 77.4,15.15 77.4,14.85 77.85,14.4 79.5,14.4 v79.95,14.85
  Bottom 0.15: R66.2 43.5,16.5 43.35,16.65 43.35,17.85 43.8,18.3 44.1,18.3 44.55,17.85 44.55,17.7 v44.7,17.7 | v46.05,18.15 46.35,17.85 51.75,17.85 52.35,18.45 53.25,18.45 53.55,18.75 54.45,18.75 54.9,18.3 61.2,18.3 61.95,17.55 68.25,17.55 68.55,17.85 v68.55,18.15 | v79.95,14.85 80.55,14.85 81.3,14.1 R59.2
N$4  (via drill 0.3)
  Top 0.5: v39.45,32.4 38.25,33.6 33,33.6 32.85,33.45 R8.1
  Bottom 0.3: T2.1 40.65,31.2
  Bottom 0.5: v39.45,32.4 39.9,32.4 40.65,31.65 40.65,31.35 T2.1
N$5
  Top 0.3: U$4.3 66.6,38.85 R87.2
N$6  (via drill 0.3)
  Top 0.3: v67.8,11.55 68.55,12.3 68.55,13.5 T8.P$6
  Bottom 0.3: v67.8,11.55 67.8,11.25 67.35,10.8 67.35,6.45 66.75,4.5 R22.2
N$7  (via drill 0.3)
  Top 0.15: v73.8,19.2 v78,15 | v40.05,17.55 40.05,16.65 39.6,16.2 IC1.13
  Bottom 0.15: v73.8,19.2 73.65,19.05 70.2,19.05 68.4,17.25 61.8,17.25 61.05,18 54.75,18 54.3,18.45 53.7,18.45 53.4,18.15 52.5,18.15 51.9,17.55 45.9,17.55 45.15,18.3 44.55,18.3 44.25,18.6 43.65,18.6 43.05,18 43.05,17.4 42.15,16.5 R64.2 40.35,16.5 39.9,16.95 39.9,17.4 v40.05,17.55 | v78,15 77.25,14.25 R57.2
N$8  (via drill 0.3)
  Top 0.15: v44.4,9.3 44.4,10.8 IC1.6
  Bottom 0.15: 44.4,11.4 45.15,12.3 R68.1 | 44.4,11.4 43.65,10.8 43.65,10.5 R67.2 | v44.4,9.3 44.4,11.4
N$9
  Top 0.3: U$4.6 65.55,32.1 65.55,31.05 65.1,30.6 R100.1
N$10  (via drill 0.3)
  Top 0.15: v6.6,8.4 8.1,8.4 OK1.3
  Bottom 0.15: v6.6,8.4 7.5,7.5 7.95,7.5 R76.1
N$11  (via drill 0.3)
  Top 0.15: v50.4,12.45 52.65,12.45 53.25,11.85 53.25,10.95 IC2.3
  Bottom 0.15: 50.55,12.3 R63.2 | 50.55,12.3 50.55,9.6 57,3.15 75.45,3.15 75.75,3.45 75.75,5.4 75.45,5.7 75.45,7.95 75.75,8.25 75.75,10.65 76.35,11.25 77.55,11.25 78,11.7 78,12.9 77.7,13.2 76.65,13.2 76.35,13.5 76.35,15 77.1,15.75 77.1,15.9 R56.2 | 50.55,12.3 v50.4,12.45
N$12  (via drill 0.3)
  Top 0.15: v52.65,9.45 52.2,9.9 52.2,10.8 IC2.2 | v69.6,15 69,15 67.65,13.65 67.65,13.05 66.6,12 v66.6,8.55
  Bottom 0.15: 52.95,9.75 52.95,10.5 R62.2 | v52.65,9.45 52.95,9.75 | v69.6,15 70.95,15 71.85,14.1 R55.2 | v66.6,8.55 54.15,8.55 52.95,9.75
N$13  (via drill 0.3)
  Top 0.3: v57.45,27.45 62.25,27.45 62.55,27.15 63.15,27.15 64.5,28.5 64.8,28.5 65.25,28.95 R88.1
  Bottom 0.3: 57.45,25.65 T4.1 57.15,25.8 57.45,26.1 57.45,26.25
  Bottom 0.406: 57.45,26.25 v57.45,27.45
N$14  (via drill 0.3)
  other vias: 90.3,45.45 91.95,46.05 94.2,43.8 89.7,43.8 89.85,44.55 89.85,43.05 94.05,43.05 94.05,44.55 92.7,45.9 91.2,45.9 93.6,45.45 93.6,42.15 90.3,42.15 91.95,41.55 92.7,41.7 91.2,41.7
  pour Bottom (no thermals): 75.6,49.2 75.6,41.4 94.65,41.4 94.65,49.2
  pour Top (no thermals): 75.6,49.2 75.6,41.4 94.65,41.4 94.65,49.2
N$15
  Top 0.3: R4.2 36.6,46.65 36.3,46.35 36.3,46.2
  Top 0.305: U$3.3 31.35,44.57 arc-45 31.44,44.79
  Top 0.406: 31.44,44.79 33.15,46.2 36.3,46.2
N$16  (via drill 0.3)
  Top 0.15: v58.8,12.6 58.5,12.3 56.7,12.3 55.95,11.55 55.95,10.95 IC2.5 | v60.75,16.65 60.9,16.65 61.35,16.2 66.75,16.2 67.5,16.95 68.25,16.95 69,17.7 69,17.85 69.45,18.3 69.75,18.3 v72,16.05
  Bottom 0.15: v72,16.05 72.15,15.9 R54.2 | R61.2 57.9,12.3 58.2,12.6 v58.8,12.6 61.5,15.3 61.5,16.2 61.2,16.5 60.9,16.5 v60.75,16.65
N$17  (via drill 0.3)
  Top 0.15: v56.55,9.45 57,9.9 57,10.8 IC2.6 | v67.2,14.85 65.25,14.85 62.55,12.15 v62.55,11.7
  Bottom 0.15: R60.2 56.25,10.5 56.25,9.75 v56.55,9.45 57.15,8.85 57.9,8.85 60.75,11.7 v62.55,11.7 | v67.2,14.85 67.95,14.1 R53.2
N$18  (via drill 0.3)
  Top 0.15: v54,17.55 53.4,16.95 53.4,16.2 IC2.12
  Bottom 0.15: 54.9,16.65 55.65,17.4 60.75,17.4 64.05,14.1 R33.2 | 54.9,16.65 53.85,15.6 52.35,15.6 51.45,14.7 R34.2 | 54.9,16.65 v54,17.55
N$19
  Top 0.3: D7.A 7.8,22.35 6.6,21.15 SV4.6
N$20
  Bottom 0.15: R12.2 97.95,27.3 96.3,28.95 96.3,34.5 94.65,36.15 LED1.A
N$21  (via drill 0.3)
  Top 0.15: v57.75,13.65 57.3,13.2 56.85,13.2 55.95,14.1 55.95,16.05 IC2.10 | v60.9,15.9 v67.2,15.9
  Bottom 0.15: v57.75,13.65 57.75,14.7 R52.2 57.9,14.7 59.1,15.9 v60.9,15.9 | v67.2,15.9 R37.2
N$22  (via drill 0.3)
  Top 0.15: v57,13.8 57,16.05 IC2.9
  Bottom 0.15: R36.2 59.25,12.3 58.35,11.4 57.3,11.4 57,11.7 v57,13.8 57,15.75 56.25,16.5 R35.2
N$23  (via drill 0.3)
  Top 0.15: v52.65,17.55 52.2,17.1 IC2.13 | v63.75,11.4 65.4,11.4 R25.2
  Bottom 0.15: 52.95,17.25 52.95,16.5 R27.2 | 52.95,17.25 v52.65,17.55 | v63.75,11.4 65.1,11.4 65.4,11.7 65.4,16.65 65.1,16.95 61.65,16.95 60.9,17.7 54.6,17.7 54.15,18.15 53.85,18.15 52.95,17.25
N$24  (via drill 0.3)
  Top 0.15: v9.3,10.8 9.9,10.2 9.9,6.45 9.3,5.85 8.25,5.85 OK1.1
  Bottom 0.15: v9.3,10.8 8.4,11.7 R74.2
N$25  (via drill 0.3)
  Top 0.3: 65.85,39.75 65.85,38.1 66.1,37.85 U$4.4 | 65.85,39.75 65.85,41.1 C32.1 | 54.15,39.6 L1.2 55.22,39.75 65.85,39.75
  other vias: 49.35,37.35 51,36.75 51,41.25 53.25,39 48.75,39 48.9,39.75 50.25,41.1 51.75,41.1 53.1,39.75 53.1,38.25 51.75,36.9 50.25,36.9 48.9,38.25 49.35,40.65 52.65,40.65 52.65,37.35 50.55,29.55 50.55,30.3 50.55,31.05 50.55,31.8 50.55,32.55 50.55,33.3 50.55,34.05 50.55,34.8 50.55,35.55 53.25,36.6 54,36.6 54.75,36.6 55.5,36.6 57.75,36.6 57,36.6 56.25,36.6 52.5,36.6
  pour Bottom (no thermals): 48,42.6 58.05,42.6 58.05,29.25 43.35,29.25 43.35,35.4 48,35.4
  pour Top (no thermals): 48,42.6 52.5,42.6 52.5,42 58.05,42 58.05,41.1 58.05,29.25 43.35,29.25 43.35,35.4 48,35.4
N$28  (via drill 0.3)
  Top 0.15: v40.05,9.45 39.6,9.9 39.6,10.8 IC1.2
  Bottom 0.15: 40.05,9.9 40.2,10.8 | R69.1 38.85,12.3 38.85,11.55 39.15,11.55 40.2,10.8 | v40.05,9.45 40.05,9.9 | 40.05,9.9 R70.2 40.2,10.8
N$30  (via drill 0.3)
  Top 0.15: 46.65,15.15 45.75,16.05 IC1.8 | 46.65,15.15 47.4,14.4 R84.2 | 46.65,15.15 v46.65,16.5
  Bottom 0.15: v46.65,16.5 R66.1
N$31
  Bottom 0.15: IC3.36 arc-90 28,16.35 28.8,16.35 arc90 29.85,17.55 QU.2 30,18.6 31.8,18.6 C21.2
N$32
  Bottom 0.15: IC3.37 arc-90 28.05,15.6 28.8,15.6 arc-90 29.85,14.55 QU.1 30,13.5 31.8,13.5 C22.2
N$33
  Top 0.3: 12.3,30.6 12.3,30 12.15,29.85 TP5.TP | 12.3,30.6 12.3,31.8 T10.P$4 | 12.3,30.6 13.95,30.6 14.25,30.9 14.25,31.8 T10.P$6
N$35
  Top 0.15: R78.2 81.15,26.7 82.5,28.05 83.25,28.05 84.6,29.4 Q1.B
N$36  (via drill 0.3)
  Top 0.15: 45.3,9.45 45.3,9.6 45.75,10.05 IC1.7 | 45.3,9.45 45.3,8.4 R91.2 | 45.3,9.45 v45.15,9.45
  Bottom 0.15: v45.15,9.45 45.15,10.5 R67.1
N$37  (via drill 0.3)
  Top 0.3: 40.65,38.85 L1.1 39.15,39 | C30.1 29.55,43.5 29.85,43.2 29.85,43.05 30.09,42.75 30.85,42.29 U$3.4 30.85,39.95
  Top 0.305: 30.85,39.95 31.8,39 39.15,39 39.3,38.85
  other vias: 45.45,37.35 43.8,36.75 43.05,36.9 44.55,36.9 41.55,39 41.7,39.75 41.7,38.25 43.8,41.25 43.05,41.1 44.55,41.1 46.05,39 45.9,39.75 45.9,38.25 45.45,40.65 42.15,40.65 42.15,37.35
  pour Bottom (no thermals): 47.4,49.2 36,49.2 36,36 47.4,36
  pour Top (no thermals): 47.4,49.2 39.15,49.2 39.15,43.5 34.65,43.5 34.65,34.35 41.25,34.35 41.25,36 47.4,36
N$39  (via drill 0.3)
  other vias: 17.55,46.05 19.2,46.65 21.45,44.4 19.95,46.5 18.45,46.5 21.3,45.15 21.3,43.65 16.95,44.4 17.1,45.15 17.1,43.65 17.55,42.9 20.85,42.9 20.85,46.05
  pour Bottom (no thermals): 13.8,49.2 13.8,42.6 26.1,42.6 26.1,49.2
  pour Top (no thermals): 13.8,49.2 13.8,42.6 26.1,42.6 26.1,49.2
N$40  (via drill 0.3)
  Top 0.15: 82.2,36.15 82.8,35.55 D5.C 82.2,36.15 | 81.75,36.6 82.2,36.15 | 81.75,36.6 80.85,37.5 79.35,37.5 R26.2 | 81.75,36.6 81.45,36.3 v81.3,36.3
  Bottom 0.15: T5.1 v81.3,36.3
N$41  (via drill 0.3)
  Top 0.15: 73.8,8.4 72.9,9.3 72.9,11.1 T9.P$1 | v72.45,8.4 73.8,8.4 | 73.8,8.4 Q8.C
  Bottom 0.15: v72.45,8.4 71.85,9 71.85,11.1 72.75,12 72.9,12.3 R39.1
N$42
  Top 0.15: R6.1 76.65,9.75 78,8.4 Q9.C
N$43
  Top 0.15: U$3.7 30.75,36.6 30.75,35.25 31.35,34.65 31.35,33.75 31.5,33.6 31.5,33.3 30.3,32.1 29.4,32.1 28.95,31.65 27.9,31.65 | 27.9,31.65 27.6,31.65 26.85,30.9 R5.2 | 27.9,31.65 R86.1
N$44
  Top 0.15: U$4.8 66.6,33.3 67.5,34.2 72.15,34.2 72.9,33.45 72.9,30 72.45,29.55 R9.1
N$46
  Top 0.15: 13.95,35.4 12.75,35.4 12.45,35.1 12.45,34.35 T10.P$3 | 13.95,35.4 14.25,35.1 14.25,34.35 T10.P$1 | 13.95,35.4 15.3,35.4 15.6,35.1 15.6,31.65 16.5,30.75 23.4,30.75 R13.2
N$48  (via drill 0.3)
  Top 0.3: T8.P$2 69.6,10.05 70.5,9.15 70.5,7.95 v71.1,7.35
  Bottom 0.3: v71.1,7.35 71.1,4.5 R21.2
N$49  (via drill 0.3)
  Top 0.3: T9.P$5 73.8,13.2 72.6,12 72.45,12 71.85,11.4 v71.85,7.65
  Bottom 0.3: v71.85,7.65 71.85,6.45 72.6,4.35 R19.2
N$50  (via drill 0.3)
  Top 0.15: 37.35,15.15 38.25,16.05 IC1.14 | 37.35,15.15 36.6,14.4 R83.2 | 37.35,15.15 v37.35,16.5
  Bottom 0.15: v37.35,16.5 R64.1
N$51  (via drill 0.3)
  Top 0.3: T9.P$2 73.8,10.05 v76.05,7.8
  Bottom 0.3: v76.05,7.8 76.05,6.45 76.8,4.5 R18.2
N$52  (via drill 0.3)
  Top 0.3: T14.P$2 82.2,13.8 82.8,14.4 83.55,14.4 v84,13.95
  Bottom 0.3: v84,13.95 84,13.2 84.6,12.6 84.6,11.25 84.15,10.8 84.15,8.4 82.2,6.45 R17.2
N$53  (via drill 0.3)
  Top 0.3: T14.P$5 82.2,10.05 v84.45,7.8
  Bottom 0.3: v84.45,7.8 84.45,6.45 85.2,4.5 R32.2
N$54  (via drill 0.3)
  Top 0.15: v71.4,11.85 69.15,11.85 68.7,11.4 68.7,11.1 T8.P$1 | v68.1,7.8 66,7.8 65.55,8.25 Q2.C 65.55,8.4 64.35,8.4 61.95,10.8 61.95,13.65 v63.6,15.3
  Bottom 0.15: v71.4,11.85 71.4,11.1 71.55,10.95 71.55,8.85 71.7,8.7 71.7,8.4 71.25,7.95 68.25,7.95 v68.1,7.8 | v63.6,15.3 63.75,15.3 64.5,16.05 R85.1
N$55
  Top 0.15: R43.2 68.7,4.35 68.7,6 Q7.B
N$56
  Top 0.15: R44.2 72.9,4.35 72.9,6 Q8.B
N$57
  Top 0.15: R45.2 78.75,4.35 77.1,6 Q9.B
N$58
  Top 0.15: R46.2 81.3,4.35 81.3,6 Q10.B
N$59
  Top 0.15: R47.2 85.5,4.35 85.5,6 Q11.B
N$60  (via drill 0.3)
  Top 0.15: R82.2 52.95,8.4 51.9,9.45 v51.45,9.45 50.7,10.2 50.85,10.8 IC2.1
  Bottom 0.15: v51.45,9.45 51.45,10.5 R62.1
N$62  (via drill 0.3)
  Top 0.15: 75.9,12.15 76.65,12.9 R6.2 | 75.9,12.15 74.85,11.1 T9.P$3 | 75.9,12.15 v75.75,12.3
  Bottom 0.15: v75.75,12.3 R40.1
N$63  (via drill 0.3)
  Top 0.15: 79.95,13.5 79.8,13.5 79.5,13.2 R50.2 79.95,13.5 | T14.P$3 79.95,13.5 | 79.95,13.5 v79.95,14.1
  Bottom 0.15: v79.95,14.1 81.3,12.3 R41.1
N$64  (via drill 0.3)
  Top 0.15: 84.9,13.2 84,13.2 83.7,13.5 T14.P$1 | 84.9,13.2 v86.4,13.2 | 84.9,13.2 R49.2
  Bottom 0.15: v86.4,13.2 86.4,13.05 85.65,12.3 R42.1
N$65  (via drill 0.3)
  Top 0.15: v71.1,8.55 71.1,9.15 70.65,9.6 70.65,11.1 T8.P$3 | Q7.C 69.6,8.4 69.45,8.55 v68.55,8.55 67.2,9.9 67.2,11.85 v67.65,12.3
  Bottom 0.15: v68.55,8.55 v71.1,8.55 | v67.65,12.3 R38.1
N$66  (via drill 0.3)
  Top 0.15: 57.9,9.45 58.35,9.9 58.35,10.8 IC2.7 | 57.9,9.45 57.9,8.4 R81.2 | 57.9,9.45 v57.75,9.45
  Bottom 0.15: v57.75,9.45 57.75,10.5 R60.1
N$67
  Top 0.15: R49.1 84.9,9.9 86.4,8.4 Q11.C
N$68
  Top 0.15: R50.1 79.5,11.1 82.2,8.4 Q10.C
N$69  (via drill 0.3)
  Top 0.15: 59.25,15.15 58.5,15.15 IC2.8 | 59.25,15.15 60,14.4 R80.2 | 59.25,15.15 v59.25,16.5
  Bottom 0.15: v59.25,16.5 R35.1
N$70  (via drill 0.3)
  Top 0.15: 49.95,15.15 50.85,16.05 IC2.14 | 49.95,15.15 49.2,14.4 R79.2 | 49.95,15.15 v49.95,16.5
  Bottom 0.15: v49.95,16.5 R27.1
N$71
  Top 0.15: R15.1 30.3,30.75 30.6,30.45 31.35,30.45 38.25,23.55 40.8,23.55 41.85,24.6 47.85,24.6 54.6,31.35 R7.2 54.6,31.5 56.7,31.5 R1.2
N$72
  Top 0.3: U$3.10 32.4,36.6 32.4,36
  Top 0.4: 32.4,36 32.4,35.55 32.7,35.25 R8.2
N$73  (via drill 0.3)
  Top 0.3: 38.55,46.8 R4.1 38.7,46.95 38.77,46.88
  Top 0.305: 38.4,46.65 38.55,46.8 38.61,46.86
  Top 0.406: v39.15,47.25 38.77,46.88 38.7,46.8
  Bottom 0.3: 40.05,47.25 40.2,47.25 40.95,48 T1.1
  Bottom 0.406: v39.15,47.25 40.05,47.25
N$74
  Top 0.15: U$3.8 31.35,35.1 31.65,34.8 31.65,33.9 31.8,33.75 31.8,33.15 30.45,31.8 29.55,31.8 28.65,30.9 R3.2
N$75  (via drill 0.3)
  Top 0.15: v27,48 26.4,47.4 26.4,36.75 25.05,35.4 25.05,33.3 | v27.15,49.2 27.3,49.05 38.25,49.05 v38.4,49.2 | v38.25,48 38.4,48.15 39,48.15 39.75,47.4 39.75,47.1 39.15,46.5 39.15,45.45 38.1,44.4 R23.2 | R16.1 25.05,33.3 | 25.05,33.3 26.1,33.3 R14.2
  Bottom 0.15: v27,48 27.15,48.15 v27.15,49.2 | v38.4,49.2 38.4,48.45 v38.25,48
N$76
  Top 0.15: U$3.6 30.3,36.6 28.8,38.1 R73.1
N$77
  Top 0.3: U$3.2 31.85,42.9 C30.2 D2.C
N$78  (via drill 0.3)
  Top 0.15: R92.2 39.75,8.4 39.45,9.45 v38.85,9.45 38.1,10.2 38.25,10.8 IC1.1
  Bottom 0.15: v38.85,9.45 38.85,10.5 R70.1
N$79
  Top 0.3: U$4.10 67.65,32.1 67.65,29.25 67.35,28.95 R88.2
N$80  (via drill 0.3)
  Top 0.5: v60,39 60.15,39.15 65.1,39.15 65.25,39 65.1,38.85 R87.1
  Bottom 0.5: T3.1 60,38.85 v60,39
N$81
  Top 0.15: U$4.7 66.15,32.1 66.15,33 66.3,33.15 66.3,33.45 67.35,34.5 72.3,34.5 73.2,33.6 73.2,30 | 73.2,30 73.2,28.8 73.95,28.05 73.95,27.15 74.4,26.7 R10.1 | 73.2,30 74.4,30 74.7,30.3 R90.1
N$82  (via drill 0.3)
  Top 0.15: 82.2,30.3 82.35,30.45 Q1.C 82.2,30.3 | v74.55,28.65 74.55,28.8 75.6,29.85 75.6,30.45 | 75.6,30.45 75.6,33.6 75.15,34.05 R2.1 | 82.2,30.3 82.05,30.45 75.6,30.45
  Bottom 0.15: v74.55,28.65 74.4,28.5 73.05,28.5 72.75,28.2 T6.1
N$83
  Top 0.3: U$4.2 67.1,37.7 69,39.6 C32.2 69.15,41.4 69.15,44.25 D3.C
N$84
  Top 0.3: D6.C 10.8,22.8 9.15,21.15 SV4.5
N$85
  Top 0.15: R48.2 64.65,4.35 64.65,6 Q2.B
OPAMP_SUPP  (via drill 0.3)
  Top 0.3: v55.2,9.45 54.6,10.05 IC2.4 54.6,11.55 52.65,13.5 51.45,13.5 | v42,9.3 IC1.4 42,11.55 43.95,13.5 51.45,13.5 | 51.45,13.5 51.45,17.4 52.2,18.15 54.3,18.15 54.45,18 58.65,18 v58.65,20.1 | 68.55,23.1 D4.C 68.4,23.1 C40.2 64.5,23.1 D1.C 64.5,22.95 63.6,22.95 63.3,22.65 61.5,22.65 v61.5,20.1
  Bottom 0.3: v55.2,9.45 54.6,10.05 C14.2 | v42,9.3 C16.2 | v58.65,20.1 v61.5,20.1
PDI_CLK  (via drill 0.3)
  Top 0.15: v26.1,15.9 26.1,14.7 TP2.TP
  Bottom 0.15: v26.1,15.9 27.15,16.95 27.9,17.1 IC3.35
PDI_DATA  (via drill 0.3)
  Top 0.15: v26.7,18.3 26.1,17.7 26.1,17.25 TP1.TP
  Bottom 0.15: v26.7,18.3 27.9,18 IC3.34
PO1  (via drill 0.3)
  Top 0.15: R13.1 23.25,29.1 22.5,28.35 21.6,28.35 19.05,25.8 v19.05,21.75
  Bottom 0.15: v19.05,21.75 19.05,19.8 IC3.24
PWM1  (via drill 0.3)
  Top 0.15: v15.6,26.55 15.6,26.25 12.6,23.25 v12.6,7.8 | R3.1 28.65,29.1 26.4,26.85 v24.45,26.85
  Bottom 0.15: v12.6,7.8 16.5,7.8 17.85,9.15 18.6,9.15 18.9,8.85 18.9,8.25 IC3.10 | v24.45,26.85 24.3,27 16.05,27 v15.6,26.55
PWM1EN  (via drill 0.3)
  Top 0.15: v17.25,25.8 17.25,25.05 16.95,24.75 16.95,23.55 16.2,22.8 v16.2,22.5 | v13.8,22.5 13.05,22.5 12.9,22.35 12.9,12.9 v13.2,12.6 | v16.65,9.15 17.1,8.7 17.1,8.25 v17.4,7.95 | v22.65,25.95 22.5,26.1 24.75,28.35 26.1,28.35 26.85,29.1 R5.1
  Bottom 0.15: v17.25,25.8 17.4,25.65 22.35,25.65 v22.65,25.95 | v13.8,22.5 v16.2,22.5 | v13.2,12.6 13.2,9.45 13.95,8.7 16.5,8.7 16.65,8.85 v16.65,9.15 | v17.4,7.95 18,7.95 18.15,8.1 IC3.11
PWM2  (via drill 0.3)
  Top 0.15: 72.9,24.9 R9.2 72.45,24.9 71.7,24.15 v71.55,24.15 | v15.15,16.5 19.65,21 v21.9,21 | v38.4,21.9 38.1,22.2 37.95,22.2 36.9,23.25 24.45,23.25 24.3,23.4 v23.85,23.4
  Bottom 0.15: v38.4,21.9 38.4,22.05 38.55,22.2 68.85,22.2 70.8,24.15 v71.55,24.15 | v15.15,16.5 16.35,16.5 IC3.20 | v23.85,23.4 23.55,23.4 23.4,23.25 22.95,23.25 21.6,21.9 21.6,21.3 v21.9,21
PWM2EN  (via drill 0.3)
  Top 0.15: v15.15,17.25 15.45,17.25 19.35,21.15 19.35,21.3 21.45,21.3 21.9,21.75 v22.35,21.75 | v23.55,22.65 24,22.65 24.3,22.95 36.75,22.95 37.8,21.9 37.8,21.75 v38.4,21.15 | v73.05,23.55 74.4,24.9 R10.2
  Bottom 0.15: v15.15,17.25 16.35,17.25 IC3.21 | v22.35,21.75 22.95,21.75 23.55,22.35 v23.55,22.65 | v38.4,21.15 39.15,21.9 69.45,21.9 71.1,23.55 v73.05,23.55
SCK
  Bottom 0.15: IC3.27 21.3,19.8 21.3,23.55 20.55,24.3 AUX2.3
SCL
  Bottom 0.15: IC3.29 23.1,19.8 23.1,21 25.35,23.25 27.6,23.25 28.65,24.3 AUX1.2
SDA
  Bottom 0.15: IC3.28 22.35,19.8 22.35,20.7 25.95,24.3 AUX1.1
SERIAL_RX  (via drill 0.3)
  Top 0.15: v18.9,14.1 19.05,13.95 19.05,9.3 18,8.25 18,7.8 17.55,7.35 v16.8,7.35 | v5.85,8.7 4.5,7.35 3.6,7.35 3.15,6.9 2.1,6.9 OK1.7
  Bottom 0.15: IC3.32 25.5,19.65 25.5,18.3 21.3,14.1 21,14.1 20.7,14.4 19.2,14.4 v18.9,14.1 | v16.8,7.35 16.65,7.2 13.8,7.2 13.65,7.05 9.9,7.05 8.55,8.4 7.35,8.4 6.75,9 6.15,9 v5.85,8.7 5.7,8.85 3.9,8.85 3.9,6 R77.1
SERIAL_TX  (via drill 0.3)
  Top 0.15: v20.1,10.95 20.1,12.45 v20.7,13.05
  Bottom 0.15: v20.1,10.95 19.2,10.95 16.65,8.4 12.75,8.4 12,9.15 R76.2 | v20.7,13.05 26.1,18.45 26.1,19.65 IC3.33
SUPP+  (via drill 0.3)
  Top 0.3: C38.2 13.35,43.35 15.6,41.1 C8.+ | 42.15,23.25 42.3,23.1 54,23.1 57.9,27 61.95,27 62.25,26.7 64.35,26.7 64.5,26.55 D1.A | 42.15,23.25 R71.1 | v30.9,33.45 30.9,34.5 27.75,37.65 v27.75,39.45 | v31.8,32.4 31.8,30.6 38.4,24 40.5,24 v40.5,24.15 | v41.25,23.25 41.4,23.1 42.15,23.1 42.15,23.25
  Bottom 0.3: 10.95,42 8.7,42 IC5.8 | 30.75,34.8 T11.1 30.9,34.65 30.9,33.75 30.75,33.6 v30.9,33.45 31.8,32.55 v31.8,32.4 | v27.75,39.45 27.75,39.6 | v40.5,24.15 40.5,24 v41.25,23.25
  pour Bottom (rank 2, no thermals): 10.95,39.6 35.4,39.6 35.4,49.2 10.95,49.2
SUPP-A  (via drill 0.3)
  other vias: 17.55,35.7 16.95,34.2 19.2,31.95 21.45,34.2 21.3,34.95 21.3,33.45 19.95,32.1 18.45,32.1 17.1,33.45 17.1,34.95 17.55,32.55 20.85,32.55 20.85,35.7
  pour Bottom (no thermals): 16.8,36 26.4,36 26.4,29.4 16.8,29.4
  pour Top (no thermals): 16.8,36 16.8,29.4 26.4,29.4 26.4,36
TEMP_MEAS1  (via drill 0.3)
  Top 0.15: v15.9,5.7 15.9,13.8 14.4,15.3 v14.4,23.1 | R16.2 25.05,29.1 22.2,26.25 20.4,26.25 v20.4,26.4
  Bottom 0.15: C37.2 14.1,5.7 14.4,6 15.9,6 | 15.9,6 21,6 22.2,7.2 22.2,8.1 IC3.6 | 14.4,26.55 14.55,26.55 15.15,25.95 15.75,25.95 16.5,26.7 20.25,26.7 20.4,26.55 v20.4,26.4 | 14.4,26.55 12.3,26.55 R24.1 | 15.9,6 v15.9,5.7 | v14.4,23.1 14.4,26.55
TEMP_MEAS2  (via drill 0.3)
  Top 0.15: v14.85,27 v13.35,25.5 13.35,24.45 12.3,23.4 12.3,8.25 12,7.95 12,7.65 12.9,6.75 12.9,5.7 12.75,5.55 v12.45,5.55 | v27.6,27 28.2,27 30.3,29.1 30.45,29.1 R15.2
  Bottom 0.15: v14.85,27 15.15,27.3 24.15,27.3 24.45,27.45 27,27.45 27.3,27.3 v27.6,27 | v13.35,25.5 12.9,25.5 12.3,24.9 R11.1 | C36.2 12.3,4.5 12.45,4.65 v12.45,5.55 13.05,6.15 13.95,6.15 14.1,6.3 20.55,6.3 21.45,7.2 21.45,8.25 21.3,8.25 IC3.7
U_BATT_MEAS  (via drill 0.3)
  Top 0.15: v33.9,7.35 33.9,7.5 33.75,7.65 25.05,7.65 v24.3,6.9 | v33.9,9.3 34.05,9.15 34.95,10.05 34.95,15.3 39.9,20.25 v39.9,20.55 | v70.5,21.75 R72.2
  Bottom 0.15: 23.4,7.2 23.7,7.5 23.85,7.5 IC3.4 23.85,7.65 | 21.3,4.5 21.3,5.1 23.85,7.65 | 21.3,4.5 19.5,4.5 C28.2 | 21.3,4.5 R31.1 | v33.9,7.35 v33.9,9.3 | 23.85,7.65 v24.3,6.9 | v39.9,20.55 39.9,20.7 40.5,21.3 69.75,21.3 70.2,21.75 v70.5,21.75
U_CELL_M1  (via drill 0.3)
  Top 0.15: v35.55,5.7 35.4,5.85 35.7,6.15 40.5,6.15 40.65,6 42.45,6 43.05,6.6 v43.35,6.6 | v48.9,11.7 48.9,12.3 49.2,12.6 R79.1
  Bottom 0.15: 35.1,5.1 32.85,7.35 30.3,7.35 30.3,10.5 29.7,11.1 29.7,11.85 29.1,12.45 29.1,12.6 28.65,13.2 IC3.40 | 35.1,5.1 35.7,4.5 C1.2 | 35.1,5.1 35.55,5.55 v35.55,5.7 | v43.35,6.6 43.35,8.25 43.5,8.4 45.3,8.4 47.25,10.35 47.55,10.35 v48.9,11.7
U_CELL_M2  (via drill 0.3)
  Top 0.15: v33,5.4 33.15,5.55 34.65,5.55 35.55,6.45 40.65,6.45 40.8,6.3 42.3,6.3 43.2,7.2 45.9,7.2 46.35,7.65 49.2,7.65 v49.5,7.35 | v51.3,7.35 51.9,6.75 52.2,6.75 52.5,7.05 55.2,7.05 55.65,7.5 58.35,7.5 60,9.15 R80.1
  Bottom 0.15: C2.2 33.9,4.5 v33,5.4 31.35,7.05 30.15,7.05 30,7.2 30,10.35 29.4,10.95 29.4,11.55 28.65,12.3 28.05,12.3 IC3.41 | v49.5,7.35 v51.3,7.35
U_CELL_M3  (via drill 0.3)
  Top 0.15: v30.45,6.15 30.75,6.45 32.7,6.45 33.3,5.85 34.5,5.85 35.4,6.75 40.8,6.75 40.95,6.6 42.15,6.6 43.05,7.5 45.75,7.5 46.05,7.8 46.05,7.95 v50.1,7.95 | v52.05,7.35 55.05,7.35 56.1,8.4 R81.1
  Bottom 0.15: C3.2 32.1,4.5 v30.45,6.15 30.3,6.3 29.85,6.3 29.7,6.45 29.7,10.2 29.1,10.8 29.1,11.1 28.65,11.55 28.05,11.55 IC3.42 | v50.1,7.95 51.45,7.95 v52.05,7.35
U_CELL_M4  (via drill 0.3)
  Top 0.15: v29.7,5.55 30.3,4.95 32.1,4.95 32.25,4.8 33.15,4.8 33.6,5.25 34.8,5.25 34.95,5.1 35.7,5.1 36.45,5.85 40.35,5.85 40.5,5.7 42.6,5.7 42.9,6 43.5,6 44.4,6.9 46.05,6.9 46.5,7.35 48.75,7.35 49.35,6.75 49.65,6.75 51.3,8.4 R82.1
  Bottom 0.15: C4.2 30.3,4.5 29.7,5.1 v29.7,5.55 29.7,6 29.4,6.3 29.4,10.05 28.65,10.65 IC3.43
U_CELL_M5  (via drill 0.3)
  Top 0.15: R83.1 36.6,12.6 36.15,12.15 36.15,10.35 34.05,8.25 29.1,8.25 28.5,8.85 v28.65,9
  Bottom 0.15: IC3.44 28.65,9.9 v28.65,9 28.65,6 28.5,5.85 C5.2
U_CELL_M6  (via drill 0.3)
  Top 0.15: v35.25,7.95 34.05,6.75 33.75,6.75 33.15,7.35 26.85,7.35 v26.4,6.9 | v47.4,10.95 R84.1
  Bottom 0.15: C6.2 26.7,4.5 26.4,4.8 v26.4,6.9 26.4,7.95 26.25,8.1 IC3.1 | v35.25,7.95 37.35,7.95 37.5,8.1 41.1,8.1 41.4,8.4 42.3,8.4 42.6,8.7 45.15,8.7 v47.4,10.95
U_SUPP_MEAS  (via drill 0.3)
  Top 0.15: 42,21.9 42.3,21.9 R71.2 42,21.9 | v26.7,10.65 27.75,9.6 28.8,9.6 29.85,8.55 33.9,8.55 35.25,9.9 35.25,15.15 42,21.9 | v23.7,9.45 v25.05,10.8
  Bottom 0.15: 17.7,4.5 18.9,5.7 21.3,5.7 22.95,7.35 22.95,8.25 IC3.5 23.1,8.25 23.1,8.85 v23.7,9.45 | 17.7,4.5 15.9,4.5 C27.2 | 17.7,4.5 R29.1 | v26.7,10.65 25.2,10.65 v25.05,10.8
(copper drawn outside any net)
  shapes: Bottom area x2

## Text on the board
Top: Üeberloader 03/2010 | + | huslik-elektronik.de | (c) Huslik & Probst | + | - | -
Descript: * | *